# EAGLE design M5stampS3_round_lcd (EAGLE 7.7.0)
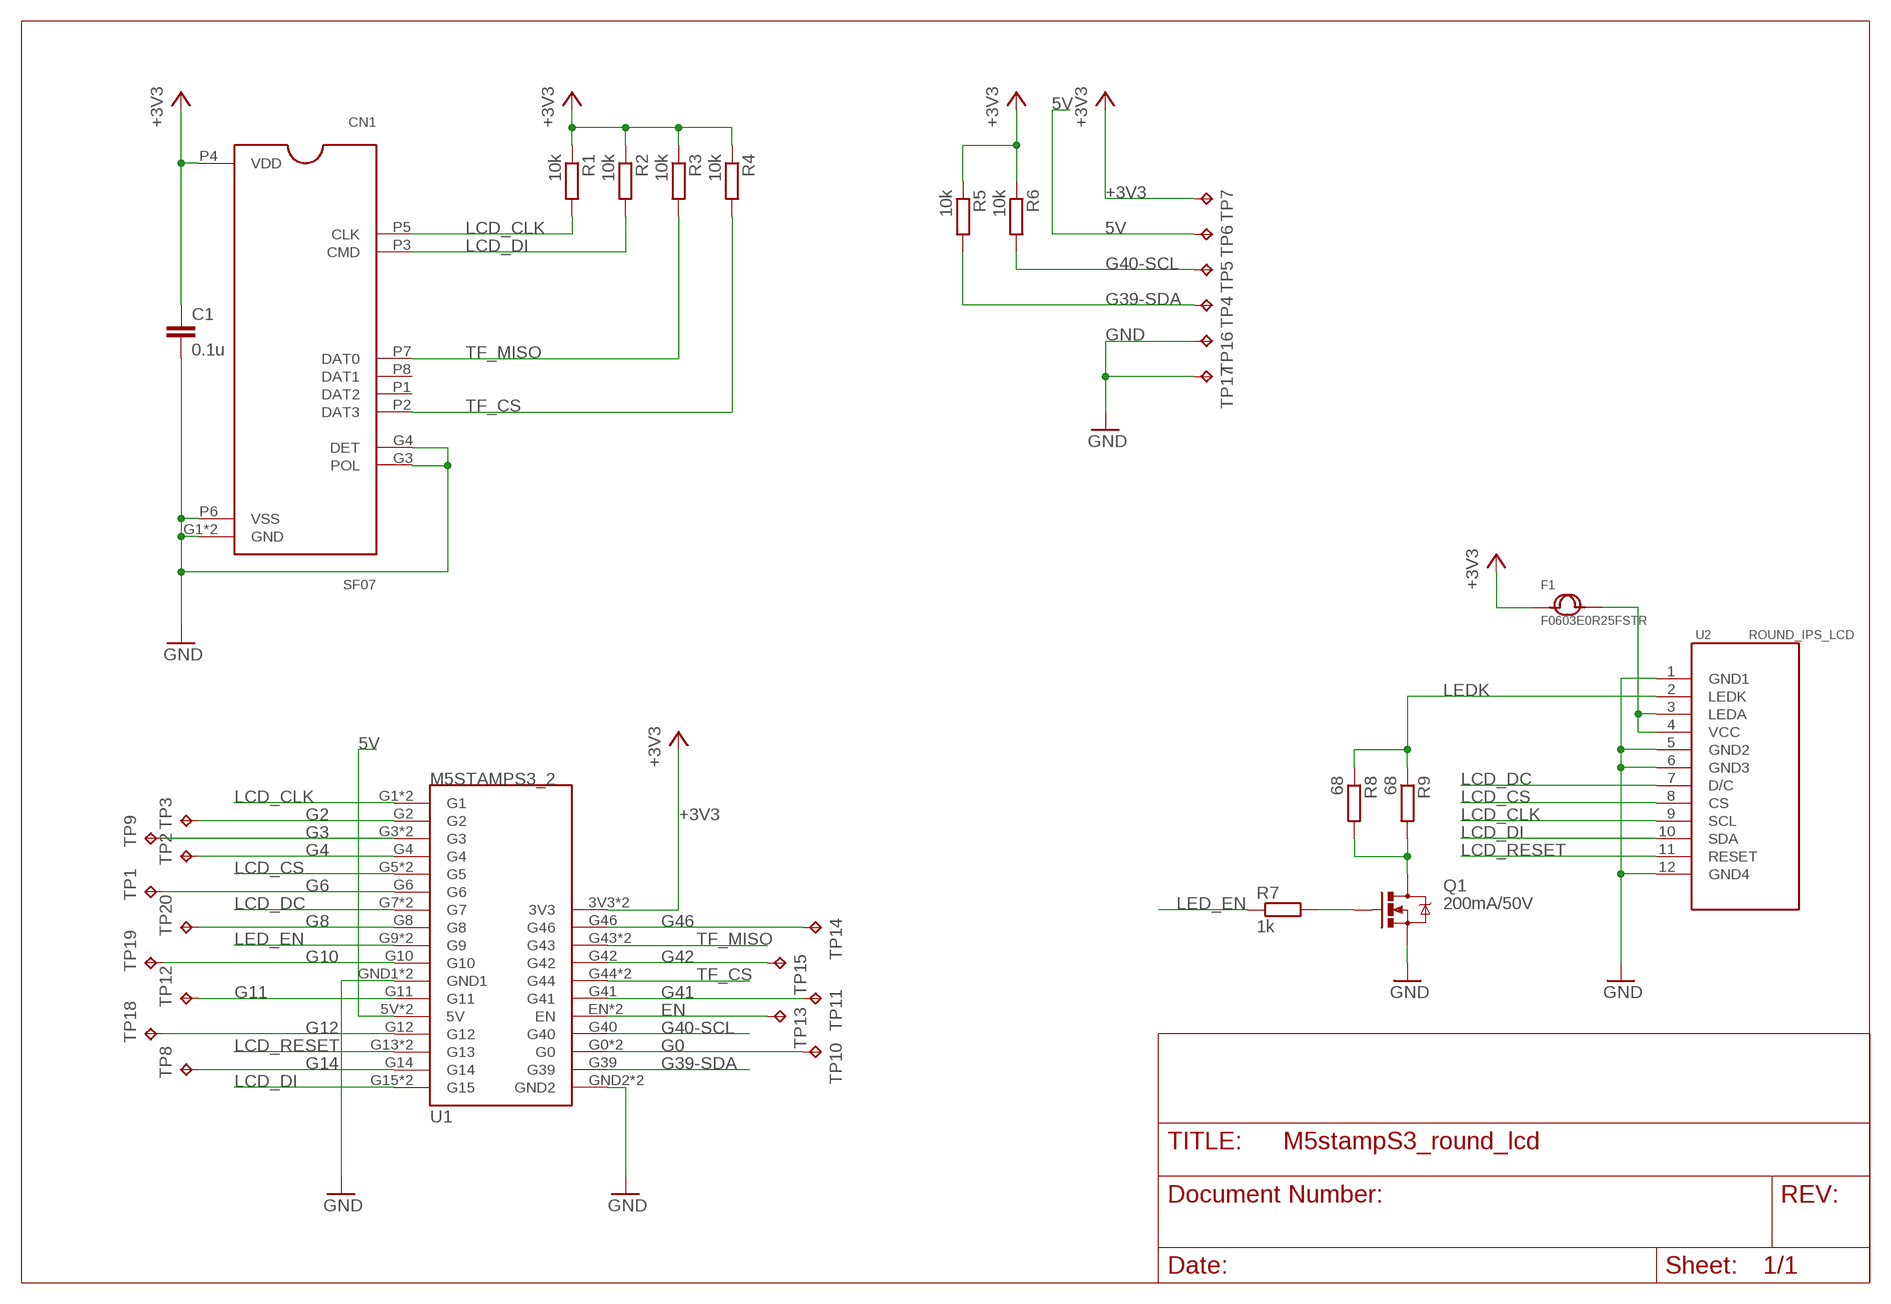
[diagram p0: schematic, sheet 1]

## Parts
C1  0.1u  C-EUC0603  [C0603]
CN1  SF07  [POS-8]
F1  F0603E0R25FSTR  FUSE0603  [C0603]
Q1  200mA/50V  MOSFET-NCHANNELBSS138  [SOT23-3]
R1  10k  R-EU_R0603  [R0603]
R2  10k  R-EU_R0603  [R0603]
R3  10k  R-EU_R0603  [R0603]
R4  10k  R-EU_R0603  [R0603]
R5  10k  R-EU_R0603  [R0603]
R6  10k  R-EU_R0603  [R0603]
R7  1k  R-EU_R0603  [R0603]
R8  68  R-EU_R0603  [R0603]
R9  68  R-EU_R0603  [R0603]
TP1  TPTP18R  [TP18R]
TP2  TPTP18R  [TP18R]
TP3  TPTP18R  [TP18R]
TP4  TPTP18R  [TP18R]
TP5  TPTP18R  [TP18R]
TP6  TPTP18R  [TP18R]
TP7  TPTP18R  [TP18R]
TP8  TPTP18R  [TP18R]
TP9  TPTP18R  [TP18R]
TP10  TPTP18R  [TP18R]
TP11  TPTP18R  [TP18R]
TP12  TPTP18R  [TP18R]
TP13  TPTP18R  [TP18R]
TP14  TPTP18R  [TP18R]
TP15  TPTP18R  [TP18R]
TP16  TPTP18R  [TP18R]
TP17  TPTP18R  [TP18R]
TP18  TPTP18R  [TP18R]
TP19  TPTP18R  [TP18R]
TP20  TPTP18R  [TP18R]
U1  M5STAMPS3_2  [M5STAMPS3_2]
U2  ROUND_IPS_LCD  [ROUND_IPS_LCD]

## Nets
5V [usbvcc]: TP6.TP U1.5V U1.5V_(5V)
+3V3 [pow]: C1.1 CN1.P4(VDD) F1.1 R1.1 R2.1 R3.1 R4.1 R5.1 R6.1 TP7.TP U1.3V3 U1.3V3_(3V3)
EN: TP13.TP U1.EN U1.EN_(EN)
G0: TP10.TP U1.G0 U1.G0_(G0)
G2: TP3.TP U1.G2
G3: TP9.TP U1.G3 U1.G3_(G3)
G4: TP2.TP U1.G4
G6: TP1.TP U1.G6
G8: TP20.TP U1.G8
G10: TP19.TP U1.G10
G11: TP12.TP U1.G11
G12: TP18.TP U1.G12
G14: TP8.TP U1.G14
G39-SDA: R5.2 TP4.TP U1.G39
G40-SCL: R6.2 TP5.TP U1.G40
G41: TP11.TP U1.G41
G42: TP15.TP U1.G42
G46: TP14.TP U1.G46
GND [pow]: C1.2 CN1.G1(GND) CN1.G2(GND) CN1.G3(POL) CN1.G4(DET) CN1.P6(VSS) Q1.2(S) TP16.TP TP17.TP U1.GND1 U1.GND1_(GND1) U1.GND2 U1.GND2_(GND2) U2.1(GND1) U2.5(GND2) U2.6(GND3) U2.12(GND4)
LCD_CLK: CN1.P5(CLK) R1.2 U1.G1 U1.G1_(G1) U2.9(SCL)
LCD_CS: U1.G5 U1.G5_(G5) U2.8(CS)
LCD_DC: U1.G7 U1.G7_(G7) U2.7(D/C)
LCD_DI: CN1.P3(CMD) R2.2 U1.G15 U1.G15_(G15) U2.10(SDA)
LCD_RESET: U1.G13 U1.G13_(G13) U2.11(RESET)
LED_EN: R7.1 U1.G9 U1.G9_(G9)
LEDK [usbvcc]: R8.1 R9.1 U2.2(LEDK)
N$1 [usbvcc]: Q1.3(D) R8.2 R9.2
N$2: Q1.1(G) R7.2
N$3 [usbvcc]: F1.2 U2.3(LEDA) U2.4(VCC)
TF_CS: CN1.P2(DAT3) R4.2 U1.G44 U1.G44_(G44)
TF_MISO: CN1.P7(DAT0) R3.2 U1.G43 U1.G43_(G43)
Unconnected: CN1.P1(DAT2) CN1.P8(DAT1)

## Library data of the parts
C1 = resistor:C-EU: CAPACITOR, European symbol
CN1 = suna_lib:SF07: Conn Micro SD Card HDR 8 POS 1.1mm Solder RA SMD Embossed T/R 0.5A/Contact; AVAILABILITY: Unavailable; DESCRIPTION: Conn Micro SD Card HDR 8 POS 1.1mm Solder RA SMD Embossed T/R 0.5A/Contact; MF: Molex; MP: 47579-0001; PACKAGE: None; PRICE: None
F1 = suna_lib:FUSE
Q1 = suna_lib:MOSFET-NCHANNEL: Common NMOSFET Parts MFG P/N Store ID Prod ID FDD8780 TRANS-09984 SI7820DN TRANS-11055 FDS6630A IC-08089 2N7002PW TRANS-11151 FQP30N06L COM-10213 TRANS-10060 BSS123LT1G TRANS-08345 BSS138 TRANS-00830 BS170 2N7000; PROD_ID: TRANS-00830
R1-R9 = resistor:R-EU_: RESISTOR, European symbol
TP1-TP20 = testpad:TP: Test pad
U1 = suna_lib:M5STAMPS3
U2 = suna_lib:ROUND_IPS_LCD

## Net classes
1 pow: width 0.508 mm
2 Neopix: width 0.356 mm
3 usbvcc: width 0.508 mm, clearance 0.254 mm
4 aref: width 0.406 mm, clearance 0.254 mm

## Board
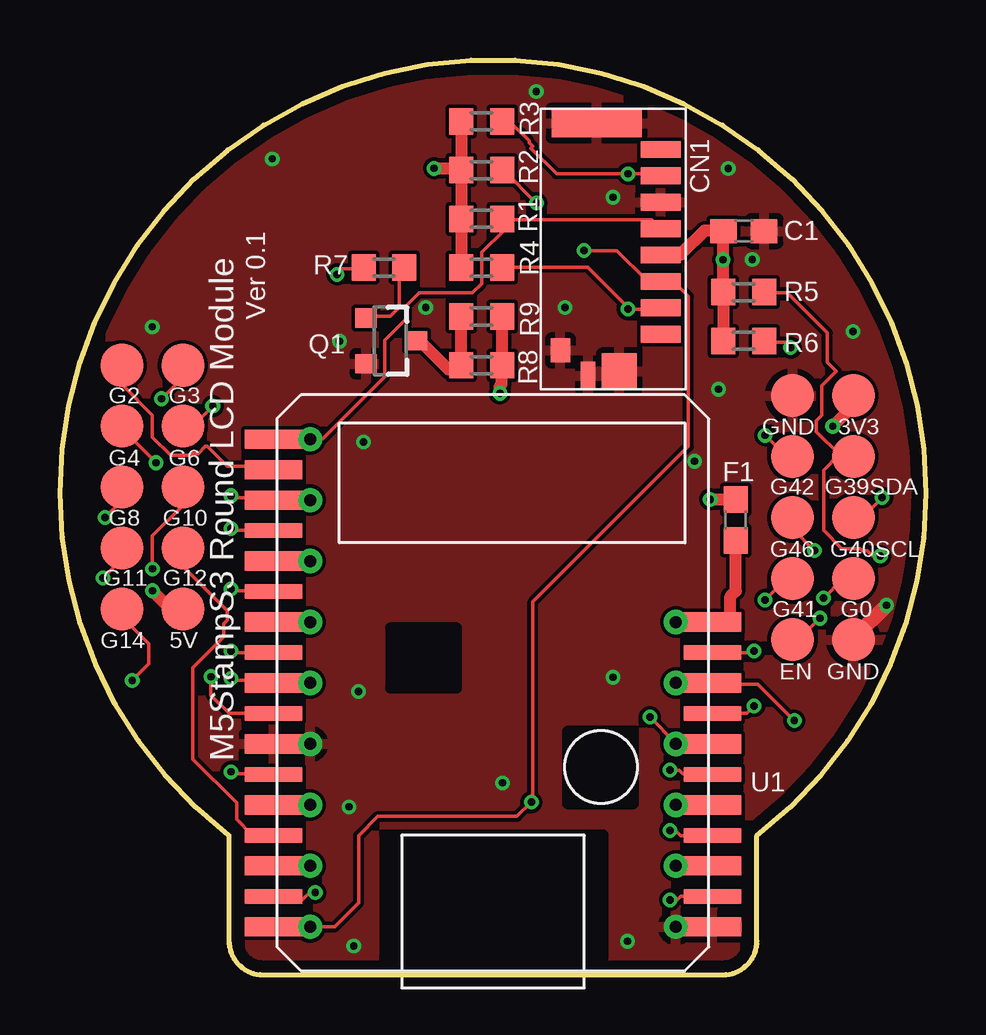
[diagram p1: board, top side]
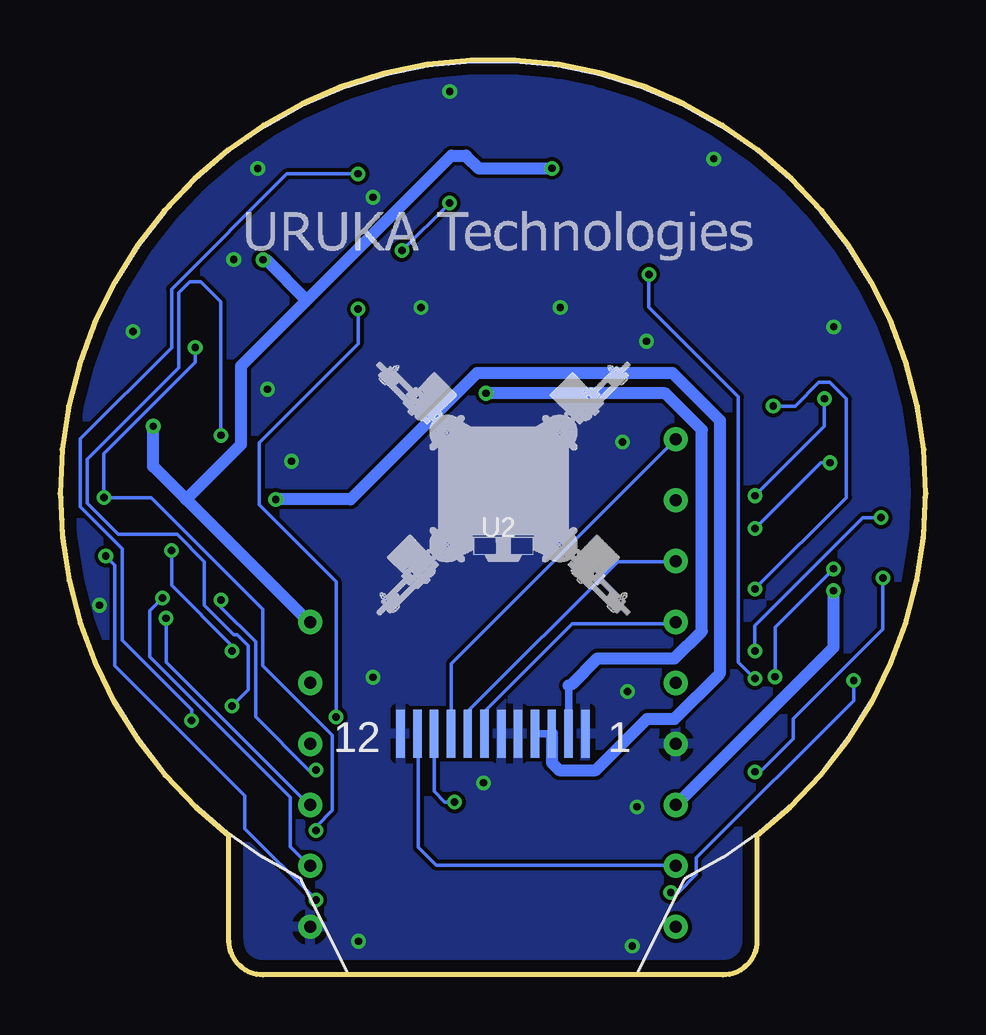
[diagram p2: board, bottom side, seen from below]

Size 36.08 x 38.12 mm. Coordinates in mm from the lower left corner, seen from the top.
Outline: 7.04,5.8 7.04,1.41 arc90 8.46,0 27.63,0 arc90 29.04,1.41 29.04,5.8 arc285 7.04,5.8
Copper layers (1*16): Top 0.035mm / dielectric 1.53mm / Bottom 0.035mm
Design rules "seeed_pban_5mil": minimum track width 6mil, minimum drill 12mil, track to track 6mil, track to pad 0.229mm, pad to pad 6mil, via to via 6mil, smd to smd 5mil, copper to edge 0.5mm, drill to drill 0.5mm, minimum pad ring 10mil, minimum via ring 6mil, stop-mask expansion 4mil, vias tented up to drill 25mil, thermal gap 10mil
tRestrict: area 13.5,0.8 to 22.6,5.8; area 21.1,7.1 to 23.9,10.2; area 13.8,11.9 to 16.6,14.5

### Footprints (pad centres in the part's own frame; a part is rotated, then mirrored left to right if it is on the bottom)
C0603 = smd 1.1 x 1: 1 -0.85,0; 2 0.85,0
POS-8 = smd 1.2 x 3.75: G1 -5.252,-2.677 | smd 1.5 x 1.45: G2 5.1,-1.729 | smd 1.15 x 0.6: G3 5.272,-3.025 | smd 1 x 0.8: G4 4.225,-4.18 | smd 0.7 x 1.65: P1 3.547,-0.001; P2 2.447,-0.001; P3 1.347,-0.001; P4 0.247,-0.001; P5 -0.853,-0.001; P6 -1.953,-0.001; P7 -3.053,-0.001; P8 -4.153,-0.001
SOT23-3 = smd 0.8 x 0.9: 1 -0.95,-1; 2 0.95,-1; 3 0,1.1
R0603 = smd 1 x 1.1: 1 -0.85,0; 2 0.85,0
TP18R = smd 1.8 x 1.8: TP 0,0
M5STAMPS3_2 = smd 2.4 x 0.8: 3V3 9.144,12.7; 5V -9.144,5.08; EN 9.144,5.08; G0 9.144,2.54; G1 -9.144,20.32; G2 -9.144,19.05; G3 -9.144,17.78; G5 -9.144,15.24; G7 -9.144,12.7; G9 -9.144,10.16; G13 -9.144,2.54; G15 -9.144,0; G43 9.144,10.16; G44 9.144,7.62; GND1 -9.144,7.62; GND2 9.144,0 | drill 0.5 pad 1: 3V3_ 7.62,12.7; 5V_ -7.62,5.08; EN_ 7.62,5.08; G0_ 7.62,2.54; G1_ -7.62,20.32; G3_ -7.62,17.78; G5_ -7.62,15.24; G7_ -7.62,12.7; G9_ -7.62,10.16; G13_ -7.62,2.54; G15_ -7.62,0; G43_ 7.62,10.16; G44_ 7.62,7.62; GND1_ -7.62,7.62; GND2_ 7.62,0 | smd 2.4 x 0.6: G4 -9.144,16.51; G6 -9.144,13.97; G8 -9.144,11.43; G10 -9.144,8.89; G11 -9.144,6.35; G12 -9.144,3.81; G14 -9.144,1.27; G39 9.144,1.27; G40 9.144,3.81; G41 9.144,6.35; G42 9.144,8.89; G46 9.144,11.43
ROUND_IPS_LCD = smd 0.35 x 2: 1 3.85,-9.95; 2 3.15,-9.95; 3 2.45,-9.95; 4 1.75,-9.95; 5 1.05,-9.95; 6 0.35,-9.95; 7 -0.35,-9.95; 8 -1.05,-9.95; 9 -1.75,-9.95; 10 -2.45,-9.95; 11 -3.15,-9.95; 12 -3.85,-9.95

### Placement (x,y rotation side)
C1  28.49,30.99 0 top
CN1  25.03,30.24 270 top
F1  28.16,18.95 90 top
Q1  13.76,26.42 270 top
R1  17.57,31.5 0 top
R2  17.57,33.53 0 top
R3  17.57,35.56 0 top
R4  17.57,29.46 0 top
R5  28.49,28.45 0 top
R6  28.49,26.42 0 top
R7  13.5,29.46 0 top
R8  17.57,25.4 180 top
R9  17.57,27.43 180 top
TP1  5.12,22.86 0 top
TP2  2.58,22.86 0 top
TP3  2.58,25.4 0 top
TP4  33.06,21.59 0 top
TP5  33.06,19.05 0 top
TP6  5.12,15.24 0 top
TP7  33.06,24.13 0 top
TP8  2.58,15.24 0 top
TP9  5.12,25.4 0 top
TP10  33.06,16.51 0 top
TP11  30.52,16.51 0 top
TP12  2.58,17.78 0 top
TP13  30.52,13.97 0 top
TP14  30.52,19.05 0 top
TP15  30.52,21.59 0 top
TP16  30.52,24.13 0 top
TP17  33.06,13.97 0 top
TP18  5.12,17.78 0 top
TP19  5.12,20.32 0 top
TP20  2.58,20.32 0 top
U1  18.04,2 0 top
U2  18.04,20 0 bottom
U$1  [QC02]  22.9,14.99 0 bottom
U$2  [URUKA]  7.25,29.78 0 top

### Tracks (layer width: path | path; a pad name or v marks a point on that pad's centre or on a via)
5V  (via drill 0.3)
  Top 0.508: TP6.TP 4.61,15.24 v3.85,16 | U1.5V 8.96,7.09 10.4,7.09 U1.5V_
  Bottom 0.508: v3.85,16 3.85,13.64 10.4,7.09 U1.5V_
+3V3  (via drill 0.3)
  Top 0.508: R6.1 27.63,26.44 27.63,28.42 R5.1 27.63,28.65 v27.63,29.79 27.63,30.94 C1.1 27.4,31.01 26.86,31.01 25.87,30.02 25.04,30.02 CN1.P4 | F1.1 28.16,18.06 28.16,16 27.93,15.77 27.93,14.94 27.7,14.71 27.24,14.71 U1.3V3 26.94,14.71 25.72,14.71 U1.3V3_ | R4.1 16.73,29.49 16.73,31.47 R1.1 16.73,31.7 16.73,33.3 R2.1 | R2.1 16.73,35.51 R3.1 | v32.2,22.86 33.04,23.7 33.04,24.08 TP7.TP | v15.59,33.6 16.5,33.6 R2.1
  Bottom 0.508: v32.2,22.86 32.2,21.18 30.83,19.81 | 30.83,19.81 25.72,14.71 U1.3V3_ | v15.59,33.6 18.63,33.6 19.17,34.14 19.78,34.14 25.8,28.12 | 25.8,28.12 28.54,25.38 28.54,22.1 30.83,19.81 | v27.63,29.79 27.47,29.79 25.8,28.12
EN  (via drill 0.3)
  Top 0.152: v31.66,14.86 30.83,14.02 30.52,14.02 TP13.TP | U1.EN 27.17,7.09 25.72,7.09 U1.EN_
  Bottom 0.152: v31.66,14.86 31.66,13.03 25.72,7.09 U1.EN_
G0  (via drill 0.3)
  Top 0.152: v31.82,15.7 32.58,16.46 33.04,16.46 TP10.TP | U1.G0 27.17,4.57 25.72,4.57 U1.G0_
  Bottom 0.152: v31.82,15.7 32.35,15.16 32.35,13.26 26.48,7.39 26.48,5.33 25.72,4.57 U1.G0_
G2
  Top 0.152: TP3.TP 2.63,25.38 2.63,24.54 3.85,23.32 3.85,22.4 4.61,21.64 5.45,21.64 5.53,21.72 5.76,21.72 6.06,22.02 6.14,22.02 6.98,21.18 8.8,21.18 8.88,21.11 U1.G2
G3  (via drill 0.3)
  Top 0.152: v4.23,24 5.07,24.84 5.07,25.38 TP9.TP | v7.13,19.96 7.2,19.89 8.8,19.89 8.88,19.81 U1.G3 8.96,19.81 10.4,19.81 U1.G3_
  Bottom 0.152: v4.23,24 4.23,22.86 v7.13,19.96
G4  (via drill 0.3)
  Top 0.152: v4,21.34 2.63,22.71 2.63,22.86 TP2.TP | v7.13,18.59 7.2,18.52 8.88,18.52 U1.G4
  Bottom 0.152: v4,21.34 4.38,21.34 v7.13,18.59
G6  (via drill 0.3)
  Top 0.152: TP1.TP 5.53,22.86 v6.37,23.7 | v7.13,16.08 7.2,16 8.88,16 U1.G6
  Bottom 0.152: v6.37,23.7 5.45,23.7 4.46,24.69 4,24.69 3.32,24 3.32,19.89 v7.13,16.08
G8  (via drill 0.3)
  Top 0.152: v1.87,19.05 2.56,19.74 2.56,20.27 TP20.TP | v7.13,13.49 7.2,13.41 8.88,13.41 U1.G8
  Bottom 0.152: v1.87,19.05 2.63,19.05 7.13,14.55 v7.13,13.49
G10  (via drill 0.3)
  Top 0.152: v3.85,16.92 3.85,18.29 5.07,19.51 5.07,20.27 TP19.TP | v6.29,12.42 6.29,11.66 7.05,10.9 8.88,10.9 U1.G10
  Bottom 0.152: v3.85,16.92 6.29,14.48 v6.29,12.42
G11  (via drill 0.3)
  Top 0.152: v1.79,16.54 2.56,17.3 2.56,17.75 TP12.TP | v7.13,8.46 7.2,8.38 8.88,8.38 U1.G11
  Bottom 0.152: v1.79,16.54 1.79,14.4 5.53,10.67 5.53,9.83 6.9,8.46 v7.13,8.46
G12
  Top 0.152: TP18.TP 5.15,17.75 5.15,16.99 6.98,15.16 6.98,14.78 6.82,14.63 6.82,14.1 5.53,12.8 5.53,8.99 7.36,7.16 7.36,6.48 7.97,5.87 8.88,5.87 U1.G12
G14  (via drill 0.3)
  Top 0.152: v3.01,12.27 3.7,12.95 3.7,13.79 2.63,14.86 2.63,15.24 TP8.TP | v10.63,3.43 10.56,3.5 10.48,3.5 10.1,3.12 9.03,3.12 8.96,3.2 U1.G14
  Bottom 0.152: v3.01,12.27 3.01,11.43 9.57,4.88 9.57,4.19 10.33,3.43 v10.63,3.43
G39-SDA  (via drill 0.3)
  Top 0.152: R5.2 29.38,28.42 30.29,28.42 31.97,26.75 31.97,25.53 32.35,25.15 31.74,24.54 31.74,23.32 31.51,23.09 31.51,22.63 32.5,21.64 33.04,21.64 TP4.TP 32.43,21.64 31.82,21.03 31.82,18.52 32.58,17.75 33.34,17.75 33.42,17.68 33.65,17.68 33.95,17.37 34.1,17.37 v34.18,17.45 | v25.42,3.12 25.72,3.12 25.87,3.28 27.17,3.28 U1.G39
  Bottom 0.152: v25.42,3.12 28.39,6.1 28.39,7.47 33.8,12.88 33.8,17.07 v34.18,17.45
G40-SCL  (via drill 0.3)
  Top 0.152: v30.45,26.14 30.22,26.36 29.38,26.36 R6.2 | v34.26,19.89 33.42,19.05 TP5.TP | v25.42,6.02 25.64,6.02 25.87,5.79 27.17,5.79 U1.G40
  Bottom 0.152: v30.45,26.14 30.45,25.53 34.26,21.72 v34.26,19.89 32.27,19.89 27.63,15.24 27.63,12.88 24.73,9.98 24.73,6.86 25.42,6.17 v25.42,6.02
G41  (via drill 0.3)
  Top 0.152: v29.38,15.62 30.22,16.46 30.52,16.46 TP11.TP | v25.42,8.53 25.8,8.53 25.95,8.38 27.17,8.38 U1.G41
  Bottom 0.152: v29.38,15.62 29.38,15.32 27.93,13.87 27.93,10.74 25.72,8.53 v25.42,8.53
G42  (via drill 0.3)
  Top 0.152: v29.38,22.48 30.22,21.64 30.52,21.64 TP15.TP | v28.92,11.2 28.62,10.9 27.24,10.9 U1.G42
  Bottom 0.152: v29.38,22.48 29.38,28.04 30.22,28.88 30.67,28.88 31.13,28.42 31.13,25.3 34.94,21.49 34.94,19.66 33.65,18.36 31.21,18.36 30.06,17.22 30.06,15.39 28.85,14.17 28.69,14.17 28.24,13.72 28.24,11.89 v28.92,11.2
G46  (via drill 0.3)
  Top 0.152: TP14.TP 30.52,18.59 v31.44,17.68 | v28.92,13.49 28.85,13.41 27.24,13.41 U1.G46
  Bottom 0.152: v31.44,17.68 31.44,16.23 28.92,13.72 v28.92,13.49
GND  (via drill 0.3)
  Top 0.61: TP17.TP 33.06,14.02 v34.44,15.4
  other vias: 19.84,36.8 27.84,33.6 28.84,29.8 33.04,26.8 23.04,12.4 12.64,22.2 18.44,8 12.04,7 23.64,1.4 12.24,1.2 3.84,27 15.24,27.8 11.64,26.4 21.04,27.8 27.44,24.4 26.44,21.4 12.44,11.8 8.84,34 23.04,32.4
  pour Top: -2.16,-2.4 38.44,-2.4 38.44,40 -2.16,40
  pour Bottom: -3.16,-1.8 37.44,-1.8 37.44,43.4 -3.16,43.4
LCD_CLK
  Top 0.152: U1.G1 8.96,22.33 10.4,22.33 U1.G1_ 10.48,22.33 10.94,22.33 13.53,24.92 13.53,26.44 14.44,27.36 14.44,27.89 14.98,28.42 17.19,28.42 17.57,28.8 17.57,30.1 18.48,31.01 18.48,31.39 R1.2 18.48,31.47 24.65,31.47 24.96,31.17 CN1.P5
  Bottom 0.152: U2.9 19.78,10.06 19.78,12.95 10.48,22.25 U1.G1_
LCD_CS
  Top 0.152: U1.G5 8.96,17.22 10.4,17.22 U1.G5_
  Bottom 0.152: U2.8 19.09,10.97 12.84,17.22 10.48,17.22 U1.G5_
LCD_DC
  Top 0.152: U1.G7 8.96,14.71 10.4,14.71 U1.G7_
  Bottom 0.152: U2.7 18.33,10.06 18.33,11.05 14.75,14.63 10.48,14.63 U1.G7_
LCD_DI  (via drill 0.3)
  Top 0.152: U1.G15 8.96,1.98 10.4,1.98 U1.G15_ 11.44,2 12.44,3 12.44,5.8 13.24,6.6 19.04,6.6 v19.64,7.2 19.7,7.24 19.7,15.54 26.18,22.02 26.18,28.27 25.57,28.88 CN1.P3 24.96,28.96 24.43,28.96 23.21,30.18 v21.83,30.18 | v19.85,32.16 18.48,33.53 R2.2
  Bottom 0.152: 20.54,10.06 U2.10 20.49,7.65 20.04,7.2 v19.64,7.2 | v21.83,30.18 v19.85,32.16
LCD_RESET
  Top 0.152: U1.G13 8.96,4.57 10.4,4.57 U1.G13_
  Bottom 0.152: U2.11 21.15,9.98 21.15,5.31 20.41,4.57 10.48,4.57 U1.G13_
LED_EN  (via drill 0.3)
  Top 0.152: v11.55,29.18 11.78,29.41 12.61,29.41 R7.1 | v7.13,12.34 7.2,12.27 8.8,12.27 8.88,12.19 U1.G9 8.96,12.19 10.4,12.19 U1.G9_
  Bottom 0.152: v11.55,29.18 11.55,27.81 7.81,24.08 7.81,13.03 v7.13,12.34
LEDK  (via drill 0.3)
  Top 0.508: R9.1 18.41,27.43 18.41,25.45 R8.1 18.41,25.15 18.41,24.61 18.33,24.54 v18.33,24.23
  Bottom 0.305: U2.2 14.89,12.05 14.94,12.1
  Bottom 0.508: v18.33,24.23 10.86,24.23 9.34,22.71 9.34,14.33 10.48,13.18 13.68,13.18 14.75,12.12 14.89,12.05
N$1
  Top 0.508: Q1.3 14.9,26.36 15.05,26.36 16.2,25.22 16.5,25.22 16.65,25.38 R8.2 16.73,25.6 R9.2
N$2
  Top 0.152: Q1.1 12.77,27.43 13.76,27.43 14.14,27.81 14.14,29.26 14.29,29.41 R7.2
N$3  (via drill 0.3)
  Top 0.508: v27.09,19.81 28.08,19.81 F1.2
  Bottom 0.305: U2.3 U2.4
  Bottom 0.508: v27.09,19.81 23.97,19.81 18.71,25.07 10.56,25.07 8.58,23.09 8.58,12.57 10.48,10.67 11.62,10.67 13.76,8.53 15.28,8.53 15.59,8.84 15.59,9.91 U2.3
TF_CS  (via drill 0.3)
  Top 0.152: U1.G44 27.17,9.6 25.72,9.6 U1.G44_ 25.64,9.68 v24.58,10.74 | 23.7,27.77 23.74,27.74 24.96,27.74 CN1.P2 | 23.7,27.77 21.99,29.49 18.48,29.49 R4.2 | v23.66,27.74 23.7,27.77
  Bottom 0.152: v24.58,10.74 24.58,16.38 27.78,19.58 27.78,22.17 23.66,26.29 v23.66,27.74
TF_MISO  (via drill 0.3)
  Top 0.152: U1.G43_ 25.72,12.19 27.17,12.19 U1.G43 27.24,12.12 29.07,12.12 v30.6,10.59 | R3.2 18.48,35.51 18.79,35.51 19.55,34.75 19.55,34.67 19.7,34.52 19.62,34.44 20.69,33.38 v23.66,33.38 24.88,33.38 24.96,33.3 CN1.P7
  Bottom 0.152: v30.6,10.59 30.6,11.05 33.49,13.95 33.49,17.75 35.25,19.51 35.25,22.33 31.44,26.14 31.44,28.57 26.64,33.38 v23.66,33.38

### Text on the board
tPlace: Ver 0.1 | G2 | G3 | GND | 3V3 | G4 | G6 | G42 | G39SDA | G8 | G10 | G46 | G40SCL | G11 | G12 | G41 | G0 | G14 | 5V | EN | GND | M5StampS3 Round LCD Module